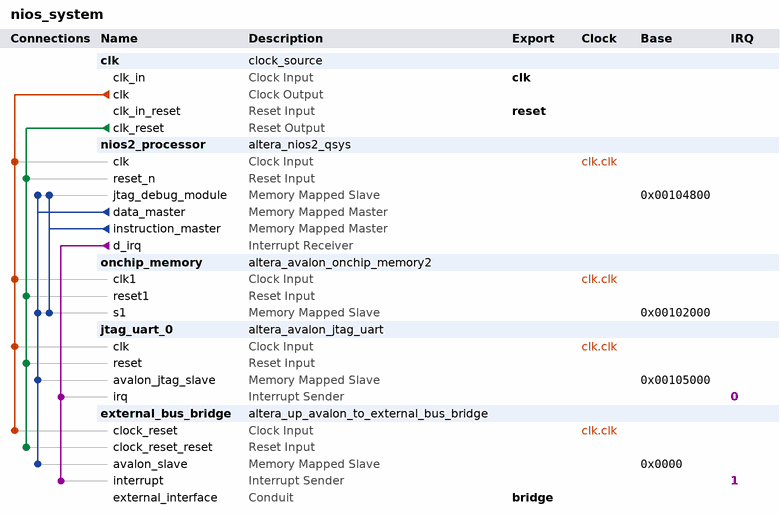
[diagram p0: system contents]
# Platform Designer (Qsys) system nios_system, Cyclone II EP2C35F672C6
# Parameters at their usual value, and those the tool derives, are not listed.
package require -exact qsys 13.0
create_system nios_system
set_project_property DEVICE_FAMILY {Cyclone II}
set_project_property DEVICE EP2C35F672C6

add_instance clk clock_source 13.0
set_instance_parameter_value clk clockFrequency 50000000

add_instance nios2_processor altera_nios2_qsys 13.0
set_instance_parameter_value nios2_processor resetSlave onchip_memory.s1
set_instance_parameter_value nios2_processor mmu_TLBMissExcSlave None
set_instance_parameter_value nios2_processor exceptionSlave onchip_memory.s1
set_instance_parameter_value nios2_processor breakSlave nios2_processor.jtag_debug_module
set_instance_parameter_value nios2_processor muldiv_multiplierType NoneSmall
set_instance_parameter_value nios2_processor impl Small
set_instance_parameter_value nios2_processor icache_size 4096

add_instance onchip_memory altera_avalon_onchip_memory2 13.0.1.99.2
set_instance_parameter_value onchip_memory dataWidth 32
set_instance_parameter_value onchip_memory dualPort false
set_instance_parameter_value onchip_memory initMemContent true
set_instance_parameter_value onchip_memory initializationFileName onchip_mem.hex
set_instance_parameter_value onchip_memory memorySize 8192

add_instance jtag_uart_0 altera_avalon_jtag_uart 13.0.1.99.2
set_instance_parameter_value jtag_uart_0 simInteractiveOptions NO_INTERACTIVE_WINDOWS

add_instance external_bus_bridge altera_up_avalon_to_external_bus_bridge 13.0
set_instance_parameter_value external_bus_bridge addr_size 1024
set_instance_parameter_value external_bus_bridge addr_size_multiplier Kbytes
set_instance_parameter_value external_bus_bridge data_size 16

# connections
add_connection clk.clk external_bus_bridge.clock_reset clock
add_connection clk.clk jtag_uart_0.clk clock
add_connection clk.clk nios2_processor.clk clock
add_connection clk.clk onchip_memory.clk1 clock
add_connection clk.clk_reset external_bus_bridge.clock_reset_reset reset
add_connection clk.clk_reset jtag_uart_0.reset reset
add_connection clk.clk_reset nios2_processor.reset_n reset
add_connection clk.clk_reset onchip_memory.reset1 reset
add_connection nios2_processor.data_master external_bus_bridge.avalon_slave avalon
set_connection_parameter_value nios2_processor.data_master/external_bus_bridge.avalon_slave baseAddress 0x0000
add_connection nios2_processor.data_master jtag_uart_0.avalon_jtag_slave avalon
set_connection_parameter_value nios2_processor.data_master/jtag_uart_0.avalon_jtag_slave baseAddress 0x00105000
add_connection nios2_processor.data_master nios2_processor.jtag_debug_module avalon
set_connection_parameter_value nios2_processor.data_master/nios2_processor.jtag_debug_module baseAddress 0x00104800
add_connection nios2_processor.data_master onchip_memory.s1 avalon
set_connection_parameter_value nios2_processor.data_master/onchip_memory.s1 baseAddress 0x00102000
add_connection nios2_processor.instruction_master nios2_processor.jtag_debug_module avalon
set_connection_parameter_value nios2_processor.instruction_master/nios2_processor.jtag_debug_module baseAddress 0x00104800
add_connection nios2_processor.instruction_master onchip_memory.s1 avalon
set_connection_parameter_value nios2_processor.instruction_master/onchip_memory.s1 baseAddress 0x00102000
add_connection nios2_processor.d_irq external_bus_bridge.interrupt interrupt
set_connection_parameter_value nios2_processor.d_irq/external_bus_bridge.interrupt irqNumber 1
add_connection nios2_processor.d_irq jtag_uart_0.irq interrupt
set_connection_parameter_value nios2_processor.d_irq/jtag_uart_0.irq irqNumber 0

# exported interfaces
add_interface clk clock sink
set_interface_property clk EXPORT_OF clk.clk_in
add_interface reset reset sink
set_interface_property reset EXPORT_OF clk.clk_in_reset
add_interface bridge conduit end
set_interface_property bridge EXPORT_OF external_bus_bridge.external_interface

set_interconnect_requirement {$system} qsys_mm.clockCrossingAdapter HANDSHAKE
set_interconnect_requirement {$system} qsys_mm.maxAdditionalLatency 1

save_system nios_system.qsys
